# EAGLE design Example_Circuit (EAGLE 8.3.2)
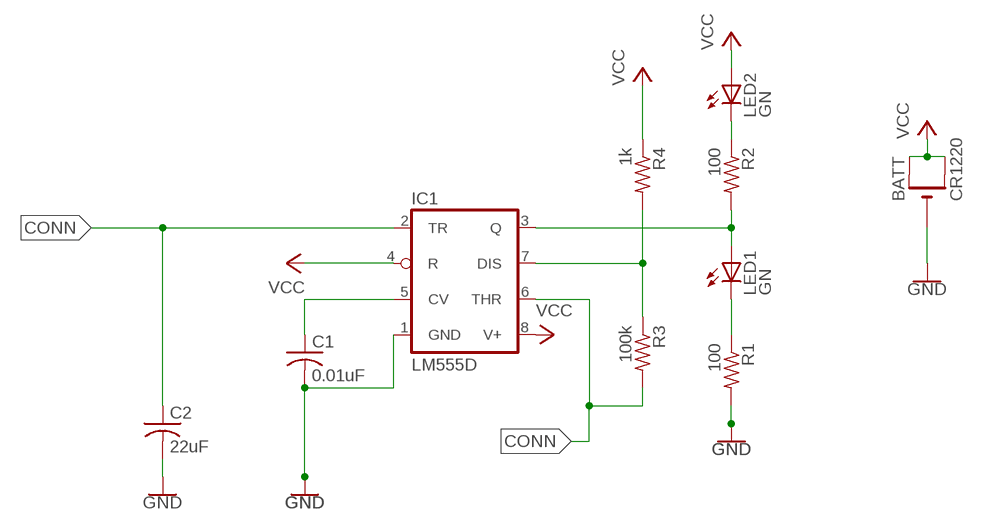
[diagram p0: schematic, sheet 1]

## Parts
BATT  CR1220  CR1220SMT  [CR1220-SMD]
C1  0.01uF  C-USC0805  [C0805]
C2  22uF  C-USC0805  [C0805]
IC1  LM555D  [SO08]
LED1  GN  LEDCHIPLED_0805  [CHIPLED_0805]
LED2  GN  LEDCHIPLED_0805  [CHIPLED_0805]
R1  100  R-US_R0805  [R0805]
R2  100  R-US_R0805  [R0805]
R3  100k  R-US_R0805  [R0805]
R4  1k  R-US_R0805  [R0805]

## Nets
CONN: C2.1 IC1.2(TR) IC1.6(THR) R3.2
GND: BATT.- C1.2 C2.2 IC1.1(GND) R1.2
N$1: LED2.C R2.1
N$2: IC1.3(Q) LED1.A R2.2
N$3: LED1.C R1.1
N$4: C1.1 IC1.5(CV)
N$6: IC1.7(DIS) R3.1 R4.2
VCC: BATT.+$1(+) BATT.+$2(+1) IC1.4(R) IC1.8(V+) LED2.A R4.1

## Library data of the parts
BATT = adafruit:CR1220: CR1216/CR1220/CR1225 12mm 3V lithium coin cell Great for battery packup. Both SMT and THM holders. Note the THM package has the ground pads on both sides of the PCB so that the masks are the same - this reduces the cost; OC_NEWARK: unknown
C1 = adafruit:C-US: CAPACITOR, American symbol; MF: VISHAY/VITRAMON; MPN: VJ0805A103JXJTW1BC; OC_NEWARK: 58J1364
C2 = adafruit:C-US: CAPACITOR, American symbol; MPN: C0805C226M8PACTU; OC_NEWARK: 23AC3797
IC1 = adafruit:*555: TIMER Changed DIP package to have round (not oval) pin pads http://www.ladyada.net/library/pcb/eaglelibrary.html; MF: NATIONAL SEMICONDUCTOR; MPN: LMC555CM/NOPB; OC_NEWARK: 41K2562
LED1 LED2 = adafruit:LED: LED OSRAM: - CHIPLED LG R971, LG N971, LY N971, LG Q971, LY Q971, LO R971, LY R971 LH N974, LH R974 LS Q976, LO Q976, LY Q976 LO Q996 - Hyper CHIPLED LW Q18S LB Q993, LB Q99A, LB R99A - SideLED LS A670, LO A670, LY A670, LG A670, LP A670 LB A673, LV A673, LT A673, LW A673 LH A674 LY A675 LS A676, LA A676, LO A676, LY A676, LW A676 LS A679, LY A679, LG A679 - Hyper Micro SIDELED® LS Y876, LA Y876, LO Y876, LY Y876 LT Y87S - SmartLED LW L88C, LW L88S LB L89C, LB L89S, LG L890 LS L89K, LO L89K, LY L89K LS L896, LA L896, LO L896, LY L896 - TOPLED LS T670, LO T670, LY T670, LG T670, LP T670 LSG T670, LSP T670, LSY T670, LOP T670, LYG T670 LG T671, LOG T671, LSG T671 LB T673, LV T673, LT T673, LW T673 LH T674 LS T676, LA T676, LO T676, LY T676, LB T676, LH T676, LSB T676, LW T676 LB T67C, LV T67C, LT T67C, LS T67K, LO T67K, LY T67K, LW E67C LS E67B, LA E67B, LO E67B, LY E67B, LB E67C, LV E67C, LT E67C LW T67C LS T679, LY T679, LG T679 LS T770, LO T770, LY T770, LG T770, LP T770 LB T773, LV T773, LT T773, LW T773 LH T774 LS E675, LA E675, LY E675, LS T675 LS T776, LA T776, LO T776, LY T776, LB T776 LHGB T686 LT T68C, LB T68C - Hyper Mini TOPLED® LB M676 - Mini TOPLED Santana® LG M470 LS M47K, LO M47K, LY M47K Source: http://www.osram.convergy.de/; MPN: MCL-S270GC; OC_NEWARK: 14N9356
R1 R2 = adafruit:R-US_: RESISTOR, American symbol; MPN: ERJ-3EKF1270V; OC_NEWARK: 53W4521
R3 = adafruit:R-US_: RESISTOR, American symbol; MPN: CPF0805B100KE1; OC_NEWARK: 06AC1379
R4 = adafruit:R-US_: RESISTOR, American symbol; MF: VISHAY/DALE; MPN: CRCW04021K00FKTD; OC_NEWARK: 01C8605

## Board
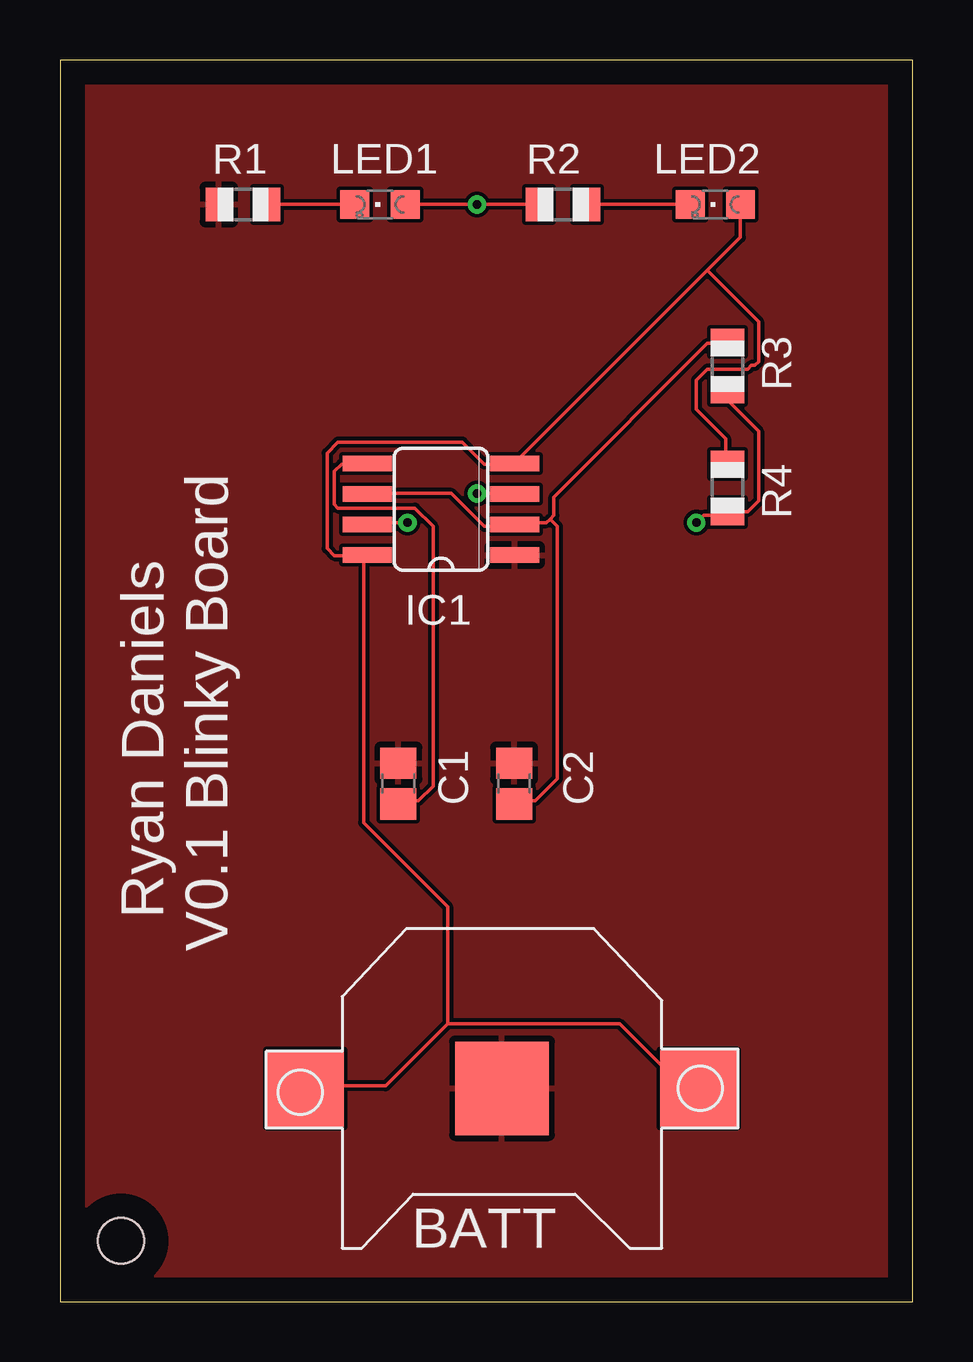
[diagram p1: board, top side]
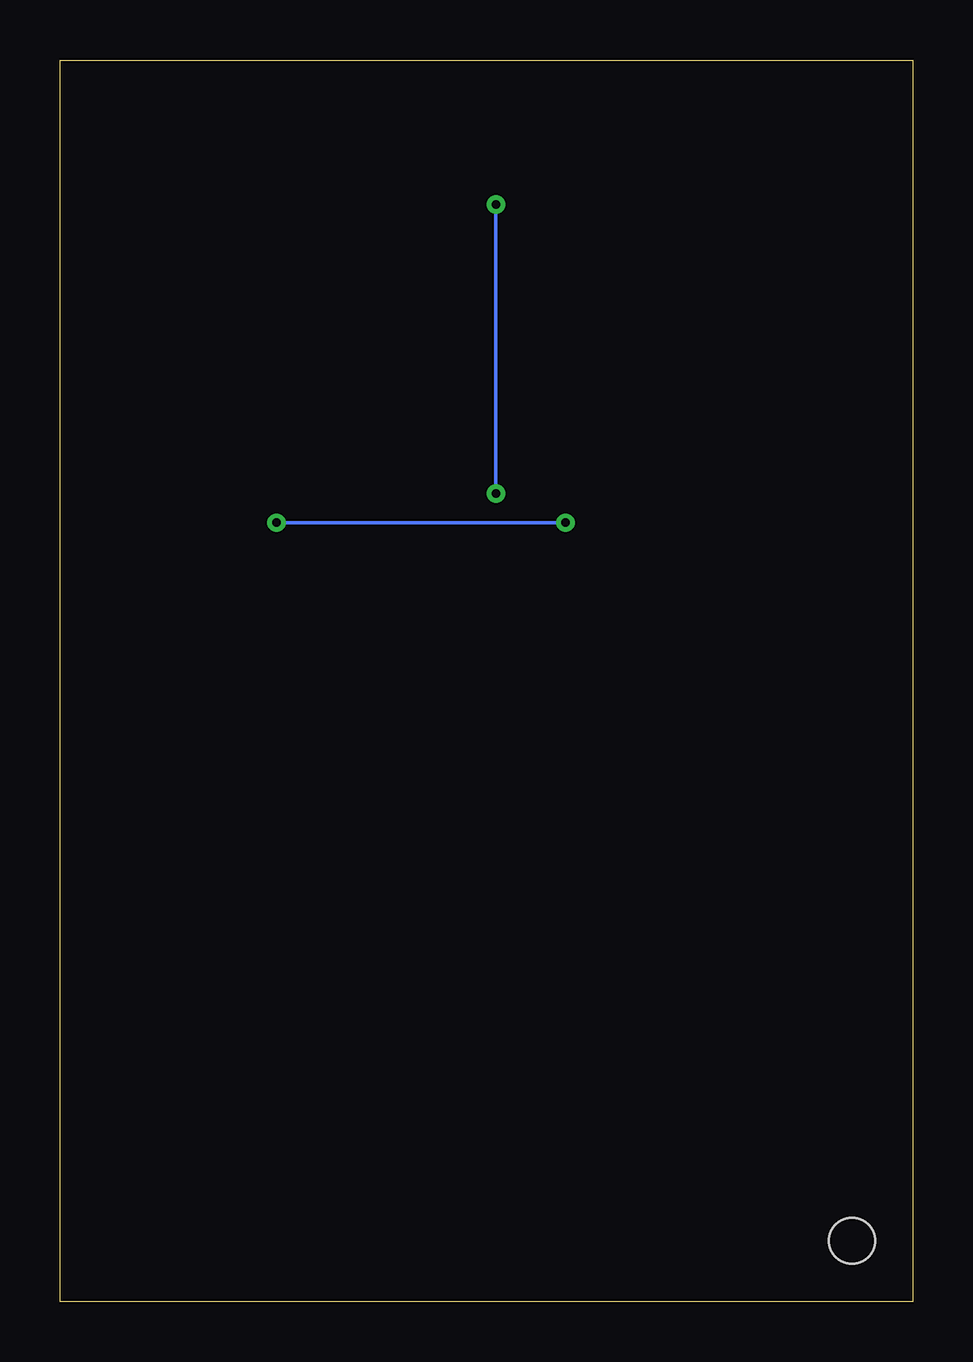
[diagram p2: board, bottom side, seen from below]

Size 35.54 x 51.74 mm. Coordinates in mm from the lower left corner, seen from the top.
Outline: 0,0 35.54,0 35.54,51.74 0,51.74 0,0
Copper layers (1*16): Top 0.035mm / dielectric 1.5mm / Bottom 0.035mm
Design rules "default": minimum track width 6mil, minimum drill 0.35mm, track to track 6mil, track to pad 6mil, pad to pad 6mil, via to via 6mil, smd to smd 6mil, copper to edge 40mil, drill to drill 6mil, minimum pad ring 10mil, minimum via ring 8mil, stop-mask expansion 4mil, vias tented up to drill 0mil, thermal gap 10mil
Holes 1.91 mm at 2.54,2.54

### Footprints (pad centres in the part's own frame; a part is rotated, then mirrored left to right if it is on the bottom)
CR1220-SMD = smd 3.2 x 3.2: +$1 -8.2,0; +$2 8.2,0 | smd 3.9 x 3.9: - 0,0
C0805 = smd 1.3 x 1.5: 1 -0.85,0; 2 0.85,0
SO08 = smd 0.66 x 2.032: 1 -1.905,-3.073; 2 -0.635,-3.073; 3 0.635,-3.073; 4 1.905,-3.073; 5 1.905,3.073; 6 0.635,3.073; 7 -0.635,3.073; 8 -1.905,3.073
CHIPLED_0805 = smd 1.2 x 1.2: A 0,-1.05; C 0,1.05
R0805 = smd 1.1 x 1.4: 1 -1,0; 2 1,0

### Placement (x,y rotation side)
BATT  18.41,8.89 180 top
C1  14.1,21.59 90 top
C2  18.92,21.59 90 top
IC1  15.88,33.02 90 top
LED1  13.34,45.72 90 top
LED2  27.3,45.72 90 top
R1  7.62,45.72 180 top
R2  20.95,45.72 180 top
R3  27.81,38.99 90 top
R4  27.81,33.91 270 top

### Tracks (layer width: path | path; a pad name or v marks a point on that pad's centre or on a via)
CONN
  Top 0.152: 20.42,32.61 20.27,32.46 19.05,32.46 IC1.2 18.9,32.31 17.68,32.31 16.31,33.68 12.8,33.68 IC1.6 | 20.42,32.61 20.57,32.77 20.57,33.53 26.98,39.93 27.74,39.93 R3.2 | 20.42,32.61 20.73,32.31 20.73,21.79 19.81,20.88 19.05,20.88 C2.1
GND
  pour Top: -2.54,53.34 -2.54,-1.27 -1.27,-2.54 38.1,-2.54 38.1,53.34
N$1
  Top 0.152: R2.1 LED2.C
N$2  (via drill 0.35)
  Top 0.152: R2.2 v17.37,45.72 LED1.A | v17.37,33.68 18.9,33.68 IC1.3
  Bottom 0.152: v17.37,45.72 v17.37,33.68
N$3
  Top 0.152: R1.1 LED1.C
N$4
  Top 0.152: C1.1 14.17,20.88 14.94,20.88 15.54,21.49 15.54,32.31 14.78,33.07 11.58,33.07 11.43,33.22 11.43,34.59 11.73,34.9 12.8,34.9 IC1.5
N$6  (via drill 0.35)
  Top 0.152: R3.1 27.89,37.95 27.89,37.49 29.11,36.27 29.11,33.38 28.65,32.92 27.89,32.92 R4.2 27.74,32.77 26.82,32.77 v26.52,32.46 | v14.48,32.46 12.8,32.46 IC1.7
  Bottom 0.152: v26.52,32.46 v14.48,32.46
VCC
  Top 0.152: 16.15,11.58 13.56,8.99 10.36,8.99 BATT.+$2 | 16.15,11.58 23.32,11.58 25.91,8.99 26.52,8.99 BATT.+$1 | 26.98,42.98 19.2,35.2 19.2,35.05 19.05,34.9 IC1.4 18.9,34.9 17.68,34.9 16.76,35.81 11.58,35.81 11.12,35.36 11.12,31.39 11.43,31.09 12.65,31.09 | 26.98,42.98 28.35,44.35 28.35,45.72 LED2.A | 26.98,42.98 29.11,40.84 29.11,39.17 28.96,39.01 28.8,39.01 28.65,38.86 26.98,38.86 26.52,38.41 26.52,37.19 27.74,35.97 27.74,35.05 R4.1 | 12.65,31.09 12.8,31.09 IC1.8 12.65,31.09 | 16.15,11.58 16.15,16.46 12.65,19.96 12.65,31.09

### Text on the board
tPlace: Ryan Daniels / V0.1 Blinky Board